# Altium schematic sheet Trinamic.SchDoc
size 420 x 297 mm; SheetNumber: 8; SheetTotal: 10; PageSetup: Record=PageOptions|CenterHorizontal=True|CenterVertical=True|PrintScale=0.96|XCorrection=1.00|YCorrection=1.00|PrintKind=1|BorderSize=5000000|LeftOffset=0|BottomOffset=0|Orientation=2|PaperLength=4318|PaperWidth=2794|Scale=100|PaperSource=7|PrintQuality=600|MediaType=1|DitherType=10|PaperKind=11" x 17"|PrintScaleMode=1
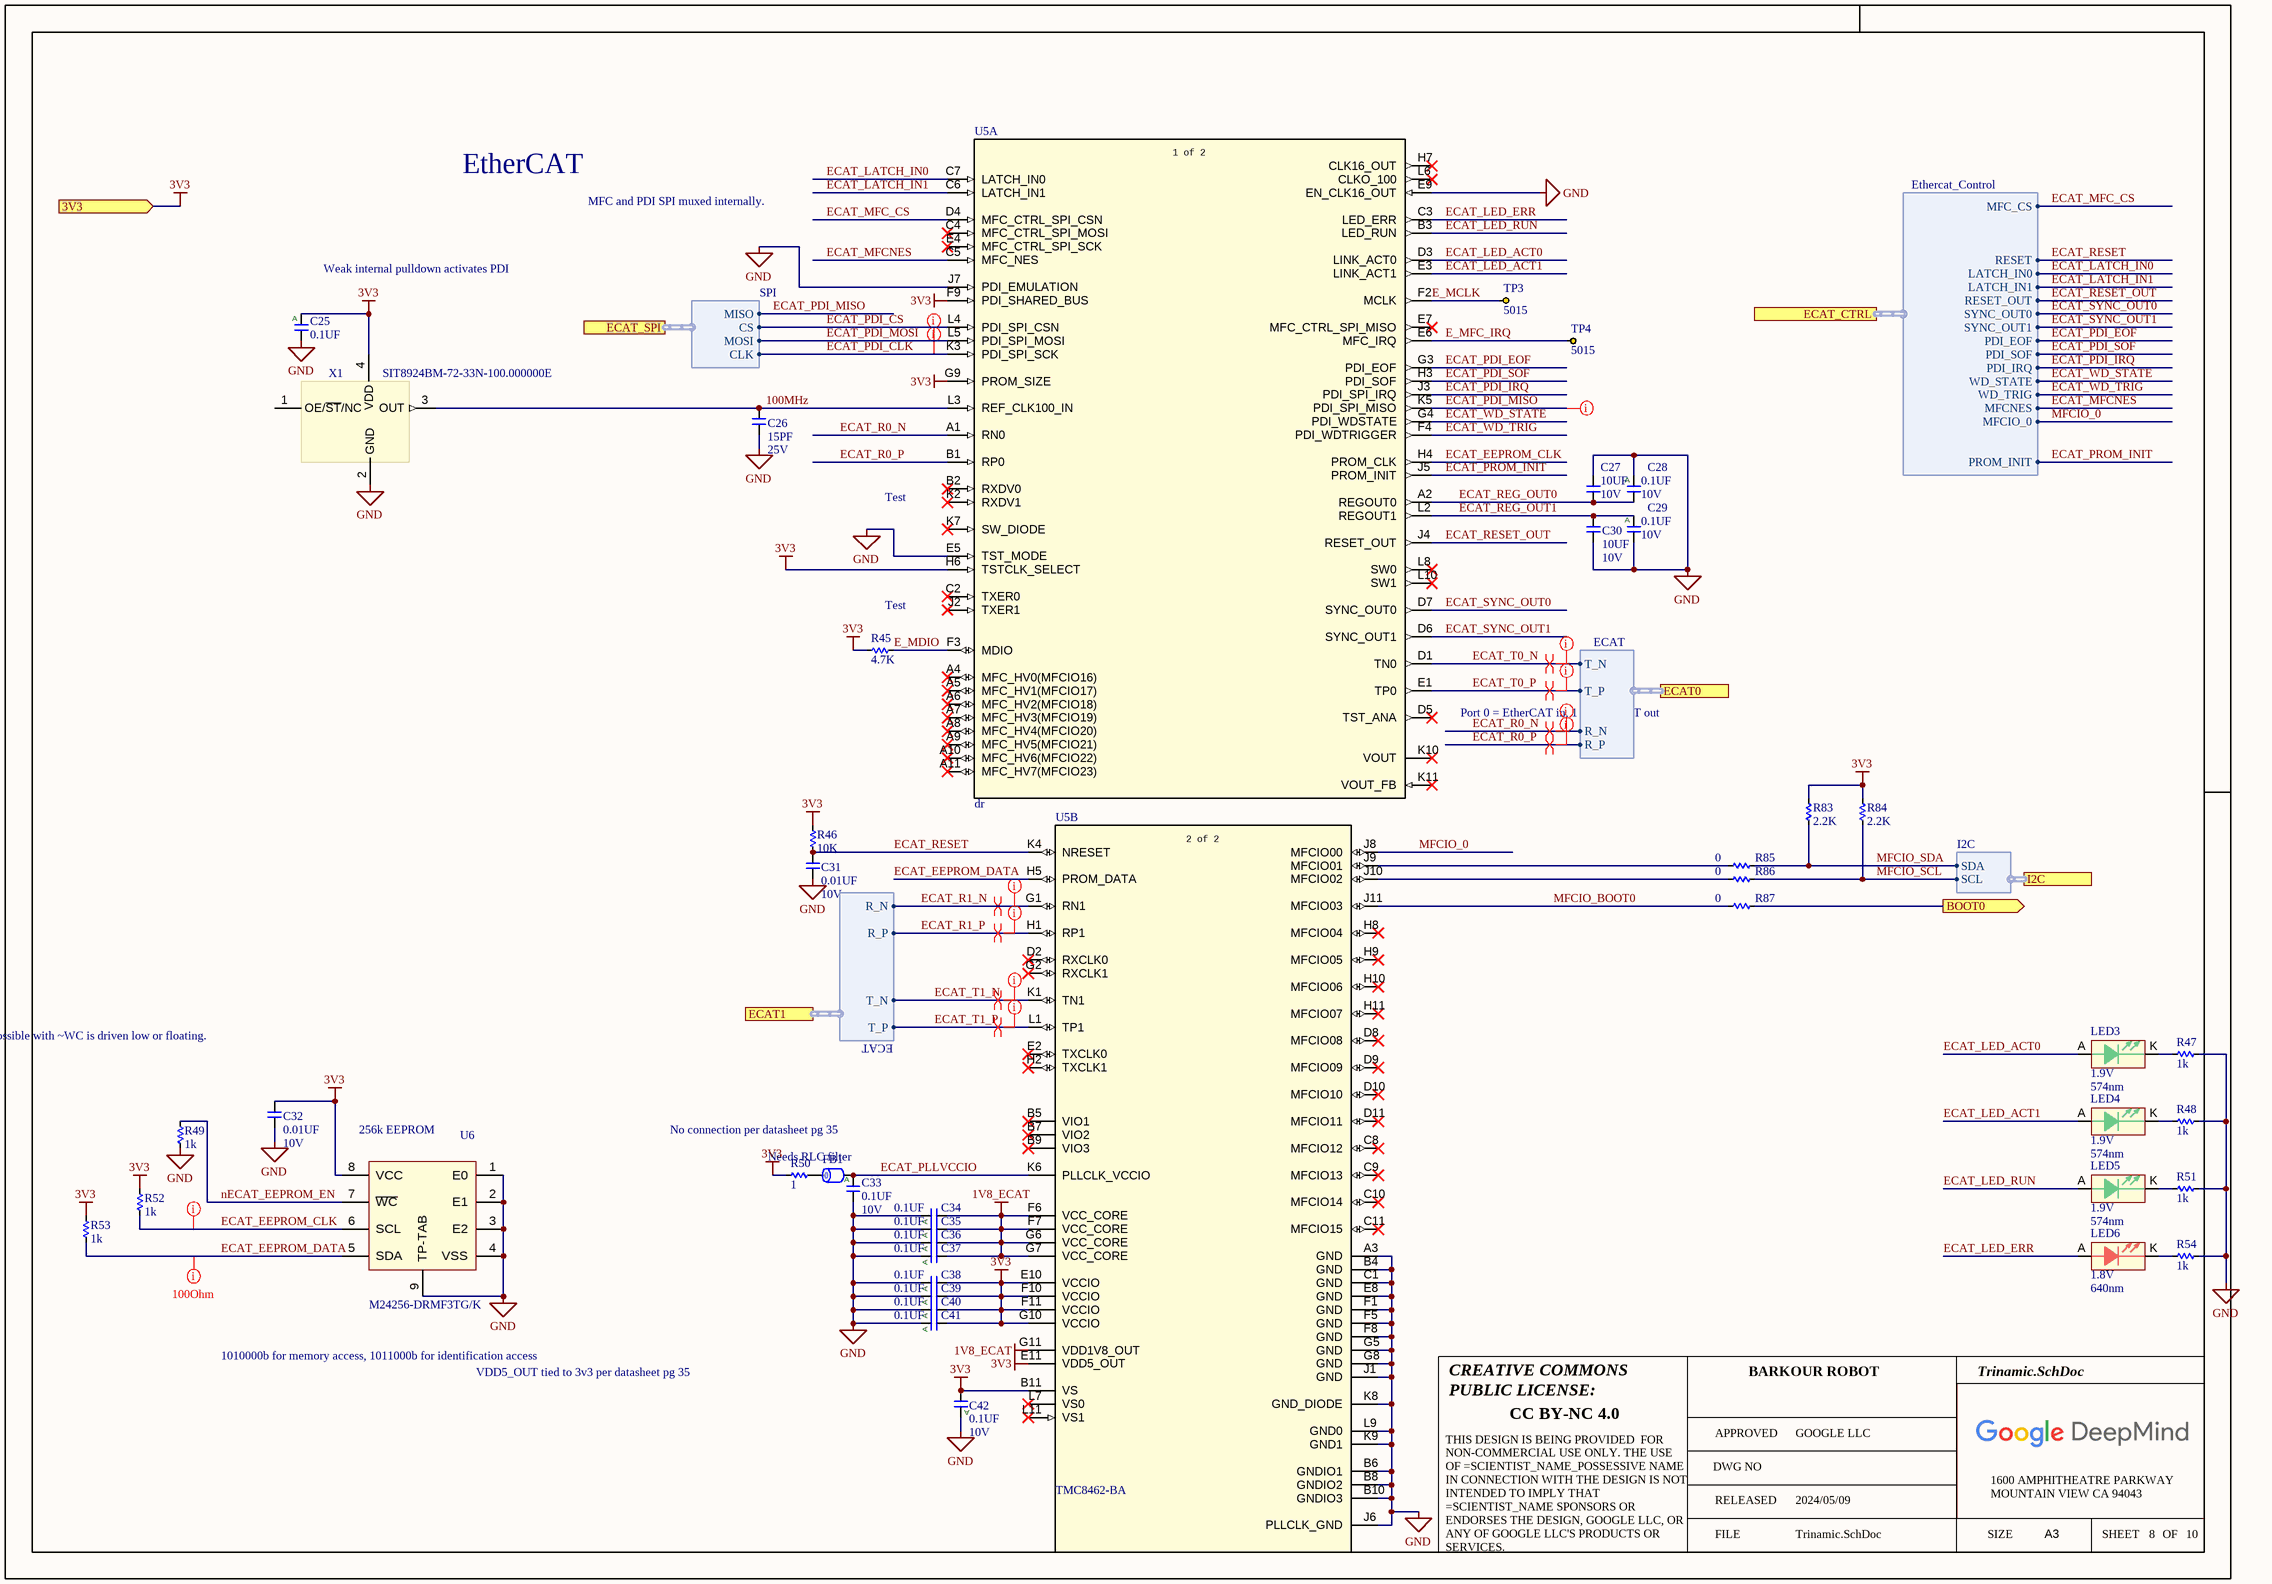
[diagram p0: Trinamic.SchDoc]

## Parts
C25  value 0.1UF  [C0201Y]  (hidden comment: __Template_Cap_Auto)
C26  value 15PF  Voltage: 25V  [C0201]  (hidden comment: __Template_Cap)
C27  value 10UF  Voltage: 10V  [C0402]  (hidden comment: __Template_Cap)
C28  value 0.1UF  Voltage: 10V  [C0201Y]  (hidden comment: __Template_Cap_Auto)
C29  value 0.1UF  Voltage: 10V  [C0201Y]  (hidden comment: __Template_Cap_Auto)
C30  value 10UF  Voltage: 10V  [C0402]  (hidden comment: __Template_Cap)
C31  value 0.01UF  Voltage: 10V  [C0201Y]  (hidden comment: __Template_Cap)
C32  value 0.01UF  Voltage: 10V  [C0201Y]  (hidden comment: __Template_Cap)
C33  value 0.1UF  Voltage: 10V  [C0201Y]  (hidden comment: __Template_Cap_Auto)
C34  value 0.1UF  [C0201Y]  (hidden comment: __Template_Cap_Auto)
C35  value 0.1UF  [C0201Y]  (hidden comment: __Template_Cap_Auto)
C36  value 0.1UF  [C0201Y]  (hidden comment: __Template_Cap_Auto)
C37  value 0.1UF  [C0201Y]  (hidden comment: __Template_Cap_Auto)
C38  value 0.1UF  [C0201Y]  (hidden comment: __Template_Cap_Auto)
C39  value 0.1UF  [C0201Y]  (hidden comment: __Template_Cap_Auto)
C40  value 0.1UF  [C0201Y]  (hidden comment: __Template_Cap_Auto)
C41  value 0.1UF  [C0201Y]  (hidden comment: __Template_Cap_Auto)
C42  value 0.1UF  Voltage: 10V  [C0201Y]  (hidden comment: __Template_Cap_Auto)
FB1  __Template_Ferrite_Bead  [L0201_H0.33MM]  (value not drawn)
LED3  Voltage – Forward (VF) (MAX) @ IF: 1.9V  Color / Wavelength: 574nm  [LED_APHHS1005LCGCK]  (hidden comment: __Template_LED_GREEN_AK)
LED4  Voltage – Forward (VF) (MAX) @ IF: 1.9V  Color / Wavelength: 574nm  [LED_APHHS1005LCGCK]  (hidden comment: __Template_LED_GREEN_AK)
LED5  Voltage – Forward (VF) (MAX) @ IF: 1.9V  Color / Wavelength: 574nm  [LED_APHHS1005LCGCK]  (hidden comment: __Template_LED_GREEN_AK)
LED6  Voltage – Forward (VF) (MAX) @ IF: 1.8V  Color / Wavelength: 640nm  [LED_APHHS1005LCGCK]  (hidden comment: __Template_LED_RED_AK)
R45  value 4.7K  [R0201_H0.26MM]  (hidden comment: __Template_Resistor)
R46  value 10K  [R0201_H0.26MM]  (hidden comment: __Template_Resistor)
R47  value 1k  [R0201_H0.26MM]  (hidden comment: __Template_Resistor)
R48  value 1k  [R0201_H0.26MM]  (hidden comment: __Template_Resistor)
R49  value 1k  [R0201_H0.26MM]  (hidden comment: __Template_Resistor)
R50  value 1  [R0201]
R51  value 1k  [R0201_H0.26MM]  (hidden comment: __Template_Resistor)
R52  value 1k  [R0201_H0.26MM]  (hidden comment: __Template_Resistor)
R53  value 1k  [R0201_H0.26MM]  (hidden comment: __Template_Resistor)
R54  value 1k  [R0201_H0.26MM]  (hidden comment: __Template_Resistor)
R83  value 2.2K  [R0201]
R84  value 2.2K  [R0201]
R85  value 0  [R0402]
R86  value 0  [R0402]
R87  value 0  [R0402]
TP3  MFG P/N: 5015  [KEYSTONE_5015_NS]  (hidden comment: KEYSTONE5015_NOSILK)
TP4  MFG P/N: 5015  [KEYSTONE_5015_NS]  (hidden comment: KEYSTONE5015_NOSILK)
U5  MFG P/N: dr  [BGA121C75P11X11_900X900X145]  (hidden comment: PROCESSOR_TRINAMIC_TMC8462-BA)  (parts A,B of 2)
U6  MFG P/N: M24256-DRMF3TG/K  [8WFDFN300X200X80-8-TP]  (hidden comment: EEPROM_M24256-DRMF3TG/K)
X1  Mfg P/N: SIT8924BM-72-33N-100.000000E  [XTAL_SIT8924BM-72-33N-100.000000]  (hidden comment: XTAL_SIT8924BM-72-33N-100.000000)

## Ports
3V3 (in), BOOT0 (out), ECAT0 (harness ECAT), ECAT1 (harness ECAT), ECAT_CTRL (harness Ethercat_Control), ECAT_SPI (harness SPI), I2C (harness I2C)

## Harnesses
Ethercat_Control: MFC_CS, LATCH_IN0, LATCH_IN1, RESET_OUT, SYNC_OUT0, SYNC_OUT1, PDI_EOF, PDI_SOF, PDI_IRQ, RESET, WD_STATE, WD_TRIG, MFCNES, MFCIO_0, PROM_INIT
SPI: MISO, MOSI, CS, CLK
ECAT: R_P, R_N, T_P, T_N
I2C: SDA, SCL

## Nets
1V8_ECAT: C34.2 C35.2 C36.2 C37.2 U5.F6(VCC_CORE) U5.F7(VCC_CORE) U5.G6(VCC_CORE) U5.G7(VCC_CORE) U5.G11(VDD1V8_OUT)
3V3: C25.1 C32.1 C38.2 C39.2 C40.2 C41.2 C42.2 R45.2 R46.2 R50.1 R52.2 R53.2 R83.2 R84.2 U5.B11(VS) U5.E10(VCCIO) U5.E11(VDD5_OUT) U5.F9(PDI_SHARED_BUS) U5.F10(VCCIO) U5.F11(VCCIO) U5.G9(PROM_SIZE) U5.G10(VCCIO) U5.H6(TSTCLK_SELECT) U6.8(VCC) X1.4(VDD) ; port 3V3
GND: C25.2 C26.2 C27.1 C28.1 C29.2 C30.2 C31.2 C32.2 C33.2 C34.1 C35.1 C36.1 C37.1 C38.1 C39.1 C40.1 C41.1 C42.1 R47.1 R48.1 R49.1 R51.1 R54.1 U5.A3(GND) U5.B4(GND) U5.B6(GNDIO1) U5.B8(GNDIO2) U5.B10(GNDIO3) U5.C1(GND) U5.E5(TST_MODE) U5.E8(GND) U5.E9(EN_CLK16_OUT) U5.F1(GND) U5.F5(GND) U5.F8(GND) U5.G5(GND) U5.G8(GND) U5.J1(GND) U5.J6(PLLCLK_GND) U5.J7(PDI_EMULATION) U5.K8(GND_DIODE) U5.K9(GND1) U5.L9(GND0) U6.1(E0) U6.2(E1) U6.3(E2) U6.4(VSS) U6.9(TP-TAB) X1.2(GND)
100MHz: C26.1 U5.L3(REF_CLK100_IN) X1.3(OUT)
BOOT0: R87.2 ; port BOOT0
E_MCLK: TP3.1 U5.F2(MCLK)
E_MDIO: R45.1 U5.F3(MDIO)
E_MFC_IRQ: TP4.1 U5.E6(MFC_IRQ)
ECAT_EEPROM_CLK: R52.1 U5.H4(PROM_CLK) U6.6(SCL)
ECAT_EEPROM_DATA: R53.1 U5.H5(PROM_DATA) U6.5(SDA)
ECAT_LATCH_IN0: U5.C7(LATCH_IN0) ; port ECAT_CTRL.LATCH_IN0
ECAT_LATCH_IN1: U5.C6(LATCH_IN1) ; port ECAT_CTRL.LATCH_IN1
ECAT_LED_ACT0: LED3.A U5.D3(LINK_ACT0)
ECAT_LED_ACT1: LED4.A U5.E3(LINK_ACT1)
ECAT_LED_ERR: LED6.A U5.C3(LED_ERR)
ECAT_LED_RUN: LED5.A U5.B3(LED_RUN)
ECAT_MFC_CS: U5.D4(MFC_CTRL_SPI_CSN) ; port ECAT_CTRL.MFC_CS
ECAT_MFCNES: U5.C5(MFC_NES) ; port ECAT_CTRL.MFCNES
ECAT_PDI_CLK: U5.K3(PDI_SPI_SCK) ; port ECAT_SPI.CLK
ECAT_PDI_CS: U5.L4(PDI_SPI_CSN) ; port ECAT_SPI.CS
ECAT_PDI_EOF: U5.G3(PDI_EOF) ; port ECAT_CTRL.PDI_EOF
ECAT_PDI_IRQ: U5.J3(PDI_SPI_IRQ) ; port ECAT_CTRL.PDI_IRQ
ECAT_PDI_MISO: U5.K5(PDI_SPI_MISO) ; port ECAT_SPI.MISO
ECAT_PDI_MOSI: U5.L5(PDI_SPI_MOSI) ; port ECAT_SPI.MOSI
ECAT_PDI_SOF: U5.H3(PDI_SOF) ; port ECAT_CTRL.PDI_SOF
ECAT_PLLVCCIO: C33.1 FB1.2 U5.K6(PLLCLK_VCCIO)
ECAT_PROM_INIT: U5.J5(PROM_INIT) ; port ECAT_CTRL.PROM_INIT
ECAT_R0_N: U5.A1(RN0) ; port ECAT0.R_N
ECAT_R0_P: U5.B1(RP0) ; port ECAT0.R_P
ECAT_R1_N: U5.G1(RN1) ; port ECAT1.R_N
ECAT_R1_P: U5.H1(RP1) ; port ECAT1.R_P
ECAT_REG_OUT0: C27.2 C28.2 U5.A2(REGOUT0)
ECAT_REG_OUT1: C29.1 C30.1 U5.L2(REGOUT1)
ECAT_RESET: C31.1 R46.1 U5.K4(NRESET) ; port ECAT_CTRL.RESET
ECAT_RESET_OUT: U5.J4(RESET_OUT) ; port ECAT_CTRL.RESET_OUT
ECAT_SYNC_OUT0: U5.D7(SYNC_OUT0) ; port ECAT_CTRL.SYNC_OUT0
ECAT_SYNC_OUT1: U5.D6(SYNC_OUT1) ; port ECAT_CTRL.SYNC_OUT1
ECAT_T0_N: U5.D1(TN0) ; port ECAT0.T_N
ECAT_T0_P: U5.E1(TP0) ; port ECAT0.T_P
ECAT_T1_N: U5.K1(TN1) ; port ECAT1.T_N
ECAT_T1_P: U5.L1(TP1) ; port ECAT1.T_P
ECAT_WD_STATE: U5.G4(PDI_WDSTATE) ; port ECAT_CTRL.WD_STATE
ECAT_WD_TRIG: U5.F4(PDI_WDTRIGGER) ; port ECAT_CTRL.WD_TRIG
MFCIO_0: U5.J8(MFCIO00) ; port ECAT_CTRL.MFCIO_0
MFCIO_BOOT0: R87.1 U5.J11(MFCIO03)
MFCIO_SCL: R84.1 R86.2 ; port I2C.SCL
MFCIO_SDA: R83.1 R85.2 ; port I2C.SDA
nECAT_EEPROM_EN: R49.2 U6.7(~{WC})
NetFB1_1: FB1.1 R50.2
NetLED3_K: LED3.K R47.2
NetLED4_K: LED4.K R48.2
NetLED5_K: LED5.K R51.2
NetLED6_K: LED6.K R54.2
NetR85_1: R85.1 U5.J9(MFCIO01)
NetR86_1: R86.1 U5.J10(MFCIO02)

Not connected (* = marked no-connect by the designer): U5 A4(MFC_HV0(MFCIO16))* A5(MFC_HV1(MFCIO17))* A6(MFC_HV2(MFCIO18))* A7(MFC_HV3(MFCIO19))* A8(MFC_HV4(MFCIO20))* A9(MFC_HV5(MFCIO21))* A10(MFC_HV6(MFCIO22))* A11(MFC_HV7(MFCIO23))* B2(RXDV0)* B5(VIO1)* B7(VIO2)* B9(VIO3)* C2(TXER0)* C4(MFC_CTRL_SPI_MOSI)* C8(MFCIO12)* C9(MFCIO13)* C10(MFCIO14)* C11(MFCIO15)* D2(RXCLK0)* D5(TST_ANA)* D8(MFCIO08)* D9(MFCIO09)* D10(MFCIO10)* D11(MFCIO11)* E2(TXCLK0)* E4(MFC_CTRL_SPI_SCK)* E7(MFC_CTRL_SPI_MISO)* G2(RXCLK1)* H2(TXCLK1)* H7(CLK16_OUT)* H8(MFCIO04)* H9(MFCIO05)* H10(MFCIO06)* H11(MFCIO07)* J2(TXER1)* K2(RXDV1)* K7(SW_DIODE)* K10(VOUT)* K11(VOUT_FB)* L6(CLKO_100)* L7(VS0)* L8(SW0)* L10(SW1)* L11(VS1)*; X1 1(OE/~{ST}/NC)

## Layout directives
net class SE50Ohm: ECAT_PDI_CLK, ECAT_PDI_MISO, ECAT_PDI_MOSI
net class Diff100Ohm: ECAT_R0_N, ECAT_R0_P, ECAT_R1_N, ECAT_R1_P, ECAT_T0_N, ECAT_T0_P, ECAT_T1_N, ECAT_T1_P
differential pair; differential pair class 100Ohm: ECAT_R0_N, ECAT_R0_P, ECAT_R1_N, ECAT_R1_P, ECAT_T0_N, ECAT_T0_P, ECAT_T1_N, ECAT_T1_P
net class SE100Ohm: ECAT_EEPROM_CLK, ECAT_EEPROM_DATA

## Notes on the sheet
- EtherCAT
- (near U5) MFC and PDI SPI muxed internally.
- Weak internal pulldown activates PDI
- (near U5) Test
- Test
- Port 0 = EtherCAT in, 1 = EtherCAT out
- Writes are possible with ~WC is driven low or floating.
- (near U6) 256k EEPROM
- (near U5) No connection per datasheet pg 35
- Needs RLC filter
- 1010000b for memory access, 1011000b for identification access
- VDD5_OUT tied to 3v3 per datasheet pg 35
- CREATIVE COMMONS
- PUBLIC LICENSE:
- BARKOUR ROBOT
- CC BY-NC 4.0
- APPROVED
- DWG NO
- GOOGLE LLC
- FILE
- RELEASED
- 2024/05/09
- SIZE
- 1600 AMPHITHEATRE PARKWAY
- MOUNTAIN VIEW CA 94043
- A3
- SHEET
- OF
- THIS DESIGN IS BEING PROVIDED  FOR NON-COMMERCIAL USE ONLY. THE USE OF =SCIENTIST_NAME_POSSESSIVE NAME IN CONNECTION WITH THE DESIGN IS NOT INTENDED TO IMPLY THAT =SCIENTIST_NAME SPONSORS OR ENDORSES THE DESIGN, GOOGLE LLC, OR ANY OF GOOGLE LLC'S PRODUCTS OR SERVICES.
- (in symbol 113, part A) 1 of 2
- (in symbol 113, part B) 2 of 2
- (in symbol 934) A

## Library data of the parts
C25 C28 C29 C33-C42 = 934: CAP, CER, X6S, 0.1uF, 10V, 10%, 0201, AUTOGRADE; ID: 934; MFG: MURATA; MFG P/N: GRT033C81A104KE01D; XPN: 150-01178-00; Gecko: 150-04546-00; EES: 150-04563-00; Status: Released; Package: 0201; Dielectric: X6S; Tolerance: 10%; Height: 0.33mm T; Supplier 1: Digi-key; HelpURL: https://www.digikey.com/product-detail/en/murata-electronics/GRT033C81A104KE01D/490-12232-1-ND/5416933; ComponentLink1Description: Datasheet; ComponentLink1URL: https://search.murata.co.jp/Ceramy/image/img/A01X/G101/ENG/GRT033C81A104KE01-01.pdf; COMMON: 150-01178-00; LOON: 150-01178-00; Supplier Part Number 1: 490-12232-1-ND
  C25 C34-C41: Voltage: 10V
C26 = 1033: CAP, CER, NP0, 15pF, 25V, 5%, 0201, 0.9mm T; ID: 1033; MFG: TDK; MFG P/N: C0603C0G1E150J030BA; XPN: 150-00968-00; EES: 150-04578-00; Status: NRND; Package: 0201; Dielectric: NP0; Tolerance: 5%; Height: 0.9mm T; ComponentLink1Description: Datasheet; COMMON: 150-00968-00; LOON: 150-00968-00; Gecko: 150-00968-00
C27 C30 = 215: CAP, CER, X5R, 10uF, 10V, 20%, 0402, 0.7mm T; ID: 215; MFG: SAMSUNG; MFG P/N: CL05A106MP5NUNC; XPN: 150-00376-00; PROXY: Use ID #1342; EES: 150-04565-00; Status: Released; Package: 0402; Dielectric: X5R; Tolerance: 20%; Height: 0.7mm T; ComponentLink1Description: Datasheet; COMMON: 150-00376-00; LOON: 150-00376-00; Gecko: 150-00376-00
C31 C32 = 361: CAP, CER, X7R, 0.01uF, 10V, 10%, AUTO GRADE, 0201, 0.33mm T; ID: 361; MFG: MURATA; MFG P/N: GCM033R71A103KA03D; XPN: 150-01021-00; EES: 150-04564-00; Status: Released; Package: 0201; Dielectric: X7R; Tolerance: 10%; Height: 0.33mm T; ComponentLink1Description: Datasheet; COMMON: 150-01021-00; LOON: 150-01021-00; Gecko: 150-01021-00
FB1 = 867: FERRITE, BEAD, 600OHMS @100MHZ, 25%, 250mA, 900 mOHM DCR, 0201; ID: 867; Catagory: Ferrite Bead; MFG: Murata Electronics North America; MFG P/N: BLM03AX601SN1D; Rdc max: 0.85; Idc max: .25; EES: 185-00325-00; ComponentLink1Description: Datasheet; Status: Released; Package: 0201 (0603 Metric); Supplier 1: Digi-Key; HelpURL: https://www.digikey.in/product-detail/en/murata-electronics-north-america/BLM03AX601SN1D/490-5624-1-ND/2485963; ComponentLink1URL: https://www.murata.com/en-us/products/productdata/8796741140510/ENFA0020.pdf; Height: 0.33mm; Supplier Part Number 1: 490-5624-1-ND
LED3-LED5 = 306: LED, GREEN, 574nm, 2mA, CLEAR, 0402; ID: 306; MFG: Kingbright; MFG P/N: APHHS1005LCGCK; Value: APHHS1005LCGCK; EES: 370-00611-00; Status: Released; Package: 0402; Category: LED; RoHS Compliant: Yes; Diode Type: LED; Mounting Type: SMD; Supplier 1: Digi-Key; HelpURL: https://www.digikey.com/product-detail/en/kingbright/APHHS1005LCGCK/754-2121-1-ND/7319049; ComponentLink1Description: Datasheet; ComponentLink1URL: http://www.kingbrightusa.com/images/catalog/SPEC/APHHS1005LCGCK.pdf; Height: 0.6mm; Supplier Part Number 1: 754-2121-1-ND
LED6 = 309: LED, RED, 640NM, 2mA, CLEAR, 0402; ID: 309; MFG: Kingbright; MFG P/N: APHHS1005LSECK/J3-PF; Value: APHHS1005LSECK/J3-PF; EES: 370-00614-00; Status: Released; Package: 0402; Category: LED; RoHS Compliant: Yes; Diode Type: LED; Mounting Type: SMD; Supplier 1: Digi-Key; HelpURL: https://www.digikey.com/product-detail/en/kingbright/APHHS1005LSECK-J3-PF/754-2123-1-ND/7319051; ComponentLink1Description: Datasheet; ComponentLink1URL: http://www.kingbrightusa.com/images/catalog/SPEC/APHHS1005LSECK-J3-PF.pdf; Height: 0.6mm; Supplier Part Number 1: 754-2123-1-ND
R45 = 10025: RES, 4.7K, 1%, 1/20W, 0201, AUTOGRADE; ID: 10025; MFG: Panasonic Electronic Components; MFG P/N: ERJ-1GNF4701C; Catagory: Chip Resistor - Surface Mount; Power: 0.05W, 1/20W; EES: 470-18032-00; Status: Released; Package: 0201; Tolerance: 1%; Height: 0.26mm; Supplier 1: Digi-Key; HelpURL: https://www.digikey.in/product-detail/en/panasonic-electronic-components/ERJ-1GNF4701C/P123031CT-ND/8343001; ComponentLink1Description: Datasheet; ComponentLink1URL: https://industrial.panasonic.com/cdbs/www-data/pdf/RDA0000/AOA0000C304.pdf; Supplier Part Number 1: P123031CT-ND
R46 = 6783: RES, 10K, 1%, 1/20W, 0201, AUTOGRADE; ID: 6783; MFG: PANASONIC; MFG P/N: ERJ1GNF1002C; COMMON: 470-00033-00; PROXY: Use ID #4151; EES: 470-18014-00; Status: Released; Package: 0201; Power: 1/20W; Tolerance: 1%; Height: 0.26mm; Supplier 1: Digi-Key; HelpURL: https://www.digikey.in/product-detail/en/panasonic-electronic-components/ERJ-1GNF1002C/P122414CT-ND/7389440; ComponentLink1Description: Datasheet; ComponentLink1URL: https://industrial.panasonic.com/cdbs/www-data/pdf/RDA0000/AOA0000C304.pdf; LOON: 470-00033-00; Gecko: 470-00033-00; XPN: 470-00033-00; Supplier Part Number 1: P122414CT-ND
R47-R49 R51-R54 = 10010: RES, 1K, 1%, 1/20W, 0201, AUTOGRADE; ID: 10010; MFG: Bourns Inc.; MFG P/N: CR0201AFW-1001GLF; Power: 0.05W, 1/20W; Catagory: Chip Resistor - Surface Mount; EES: 470-18022-00; Status: Released; Package: 0201; Tolerance: 1%; Height: 0.26mm; Supplier 1: Digi-Key; HelpURL: https://www.digikey.in/product-detail/en/bourns-inc/CR0201AFW-1001GLF/118-CR0201AFW-1001GLFCT-ND/12091423; ComponentLink1Description: Datasheet; ComponentLink1URL: https://www.bourns.com/docs/product-datasheets/crxxxxa.pdf; Supplier Part Number 1: 118-CR0201AFW-1001GLFCT-ND
R50 = 7413: RES, 1.0, 5%, 1/20W, 0201; ID: 7413; MFG: PANASONIC; MFG P/N: ERJ1GEJ1R0C; COMMON: 470-02088-00; EES: 470-17951-00; Status: NRND; Package: 0201; Power: 1/20W; Tolerance: 5%; LOON: 470-02088-00; Gecko: 470-02088-00; XPN: 470-02088-00
R83 R84 = 3569: Resistor, 2.20K Ohms, 0201, 0.05W, ±1%; ID: 3569; MFG: PANASONIC; MFG P/N: ERJ-1GEF2201C; Power: 1/20W; COMMON: 470-01004-00; Status: NRND; Package: 0201; Tolerance: 1%; Height: 0.26mm; Supplier 1: Digi-Key; XPN: 470-01004-00; Supplier Part Number 1: P2.20KABCT-ND
R85-R87 = 8004: RES, 0, JUMPER, 1/16W, 0402; ID: 8004; MFG: YAGEO; MFG P/N: RC0402FR-070RL; COMMON: 470-02332-00; PROXY: Use ID #2; Gecko: 470-17892-00; Status: Released; Package: 0402; Power: 1/16W; Tolerance: JUMPER; XPN: 470-02332-00
TP3 TP4 = 176: HW, TEST POINT, NO SILKSCREEN, PC MINIATURE, 0.25mm T, 1.52mm HEIGHT, SILVER PLATING, SMT; ID: 176; MFG: Keystone Electronics Corp.; COMMON: 250-00207-00; PROXY: 250-04113-00; KOI: 250-07313-00; XPN: XS-10008125; EES: 250-08552-00; EPIC: 250-08204-00; Status: In Development; Category: Test and Measurement; Supplier 1: Digi-Key; Height: 1.65mm; Mounting Type: SMD; HelpURL: https://www.digikey.com/product-detail/en/keystone-electronics/5015/36-5015CT-ND/278886; ComponentLink1Description: Datasheet; ComponentLink1URL: http://keyelco.com/userAssets/file/M65p55.pdf; LOON: 250-00207-00; Gecko: 250-00207-00; Supplier Part Number 1: 36-5015CT-ND
U5 = 113: IC, CONTROLLER, TMC8462, ETHERNET, 100Mb, SPI, PWM O/P, 100mA, BGA-121; ID: 113; MFG: Trinamic Motion Control GmbH; EES: 313-05813-00; Status: Released; Package: 121-BGA (9x9); Category: Integrated Circuits (ICs); RoHS Compliant: Yes; Supplier 1: Digi-Key; HelpURL: https://www.digikey.com/products/en?keywords=TMC8462-BA; ComponentLink1Description: Datasheet; ComponentLink1URL: https://www.trinamic.com/products/integrated-circuits/details/tmc8462-ba/; Height: 1.4mm; Supplier Part Number 1: 1460-1258-ND
U6 = 423: IC, MEMORY, M24256, EEPROM, 256Kb, I2C, 1MHz, MLP-8, AUTOGRADE; ID: 423; MFG: STMicroelectronics; EES: 313-05803-00; Status: Released; Package: 8-WFDFN; Category: Integrated Circuits (ICs); RoHS Compliant: Yes; Supplier 1: Digi-Key; ComponentLink1Description: Datasheet; ComponentLink1URL: https://www.st.com/content/ccc/resource/technical/document/datasheet/a7/9b/dd/87/57/59/41/8c/DM00061669.pdf/files/DM00061669.pdf/jcr:content/translations/en.DM00061669.pdf; Mounting Type: SMD; Height: 0.8mm; Supplier Part Number 1: 497-15355-6-ND; HelpURL: https://www.digikey.com/product-detail/en/stmicroelectronics/M24256-DRMF3TG-K/497-15355-6-ND/5175353
X1 = 137: OSC, MEMS, XO, 100MHZ, +/-25PPM STAB, LVCMOS, 3.3V, SMD-4, AUTOGRADE; ID: 137; Mfg: SiTIME; Current - Supply (Max): 4.8mA; Frequency Stability: ±25ppm; Output: LVCMOS, LVTTL; EES: 230-00460-00; Status: Released; Package: 4-SMD, No Lead; Category: Crystals and Oscillators; RoHS Compliant: Yes; Mounting Type: SMD; Supplier 1: Digi-Key; Frequency: 100MHz; Height: 0.8mm; Operating Temperature: -55°C ~ 125°C; Type: XO (Standard); Voltage – Supply: 3.3V; HelpURL: https://www.digikey.com/product-detail/en/sitime/SIT8924BM-72-33N-100-000000E/1473-SIT8924BM-72-33N-100-000000E-ND/11292440; ComponentLink1Description: Datasheet; ComponentLink1URL: https://source.z2data.com/2019/9/26/1/9/50/497/69995916/SiT8924.pdf; Supplier Part Number 1: 1473-SIT8924BM-72-33N-100.000000E-ND